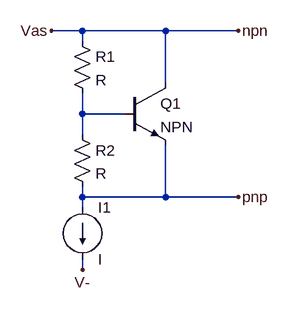
[diagram p0: schematic bias_design.asc]
bias_design.asc, the LTspice schematic file:
Version 4
SHEET 1 880 680
WIRE 160 64 112 64
WIRE 288 64 160 64
WIRE 400 64 288 64
WIRE 160 80 160 64
WIRE 288 144 288 64
WIRE 160 192 160 160
WIRE 224 192 160 192
WIRE 160 224 160 192
WIRE 160 320 160 304
WIRE 288 320 288 240
WIRE 288 320 160 320
WIRE 400 320 288 320
WIRE 160 336 160 320
WIRE 160 432 160 416
FLAG 112 64 Vas
FLAG 400 320 pnp
FLAG 400 64 npn
FLAG 160 432 V-
SYMBOL res 144 64 R0
SYMATTR InstName R1
SYMBOL res 144 208 R0
SYMATTR InstName R2
SYMBOL npn 224 144 R0
SYMATTR InstName Q1
SYMBOL current 160 336 R0
SYMATTR InstName I1

The netlist it stands for:
* bias_design.asc
R1 npn N001 R
R2 N001 pnp R
Q1 npn N001 pnp 0 NPN
I1 pnp V- I
.model NPN NPN
.model PNP PNP
.lib standard.bjt
.backanno
.end